# EasyEDA Pro project H4ptiX.epro

# Schematic Board
Board Name: Board; Create Date: 2025-03-30; Page Name: SCH; Project Name: H4ptiX Basic; Schematic Name: Board; Update Date: 2025-03-30; Add into BOM: yes; Company: @UTBDK; Convert to PCB: yes; Date: 2025-03-15; Draw By: buglloc; REV: 1.1; Sheet: 1/1; spicePre: .
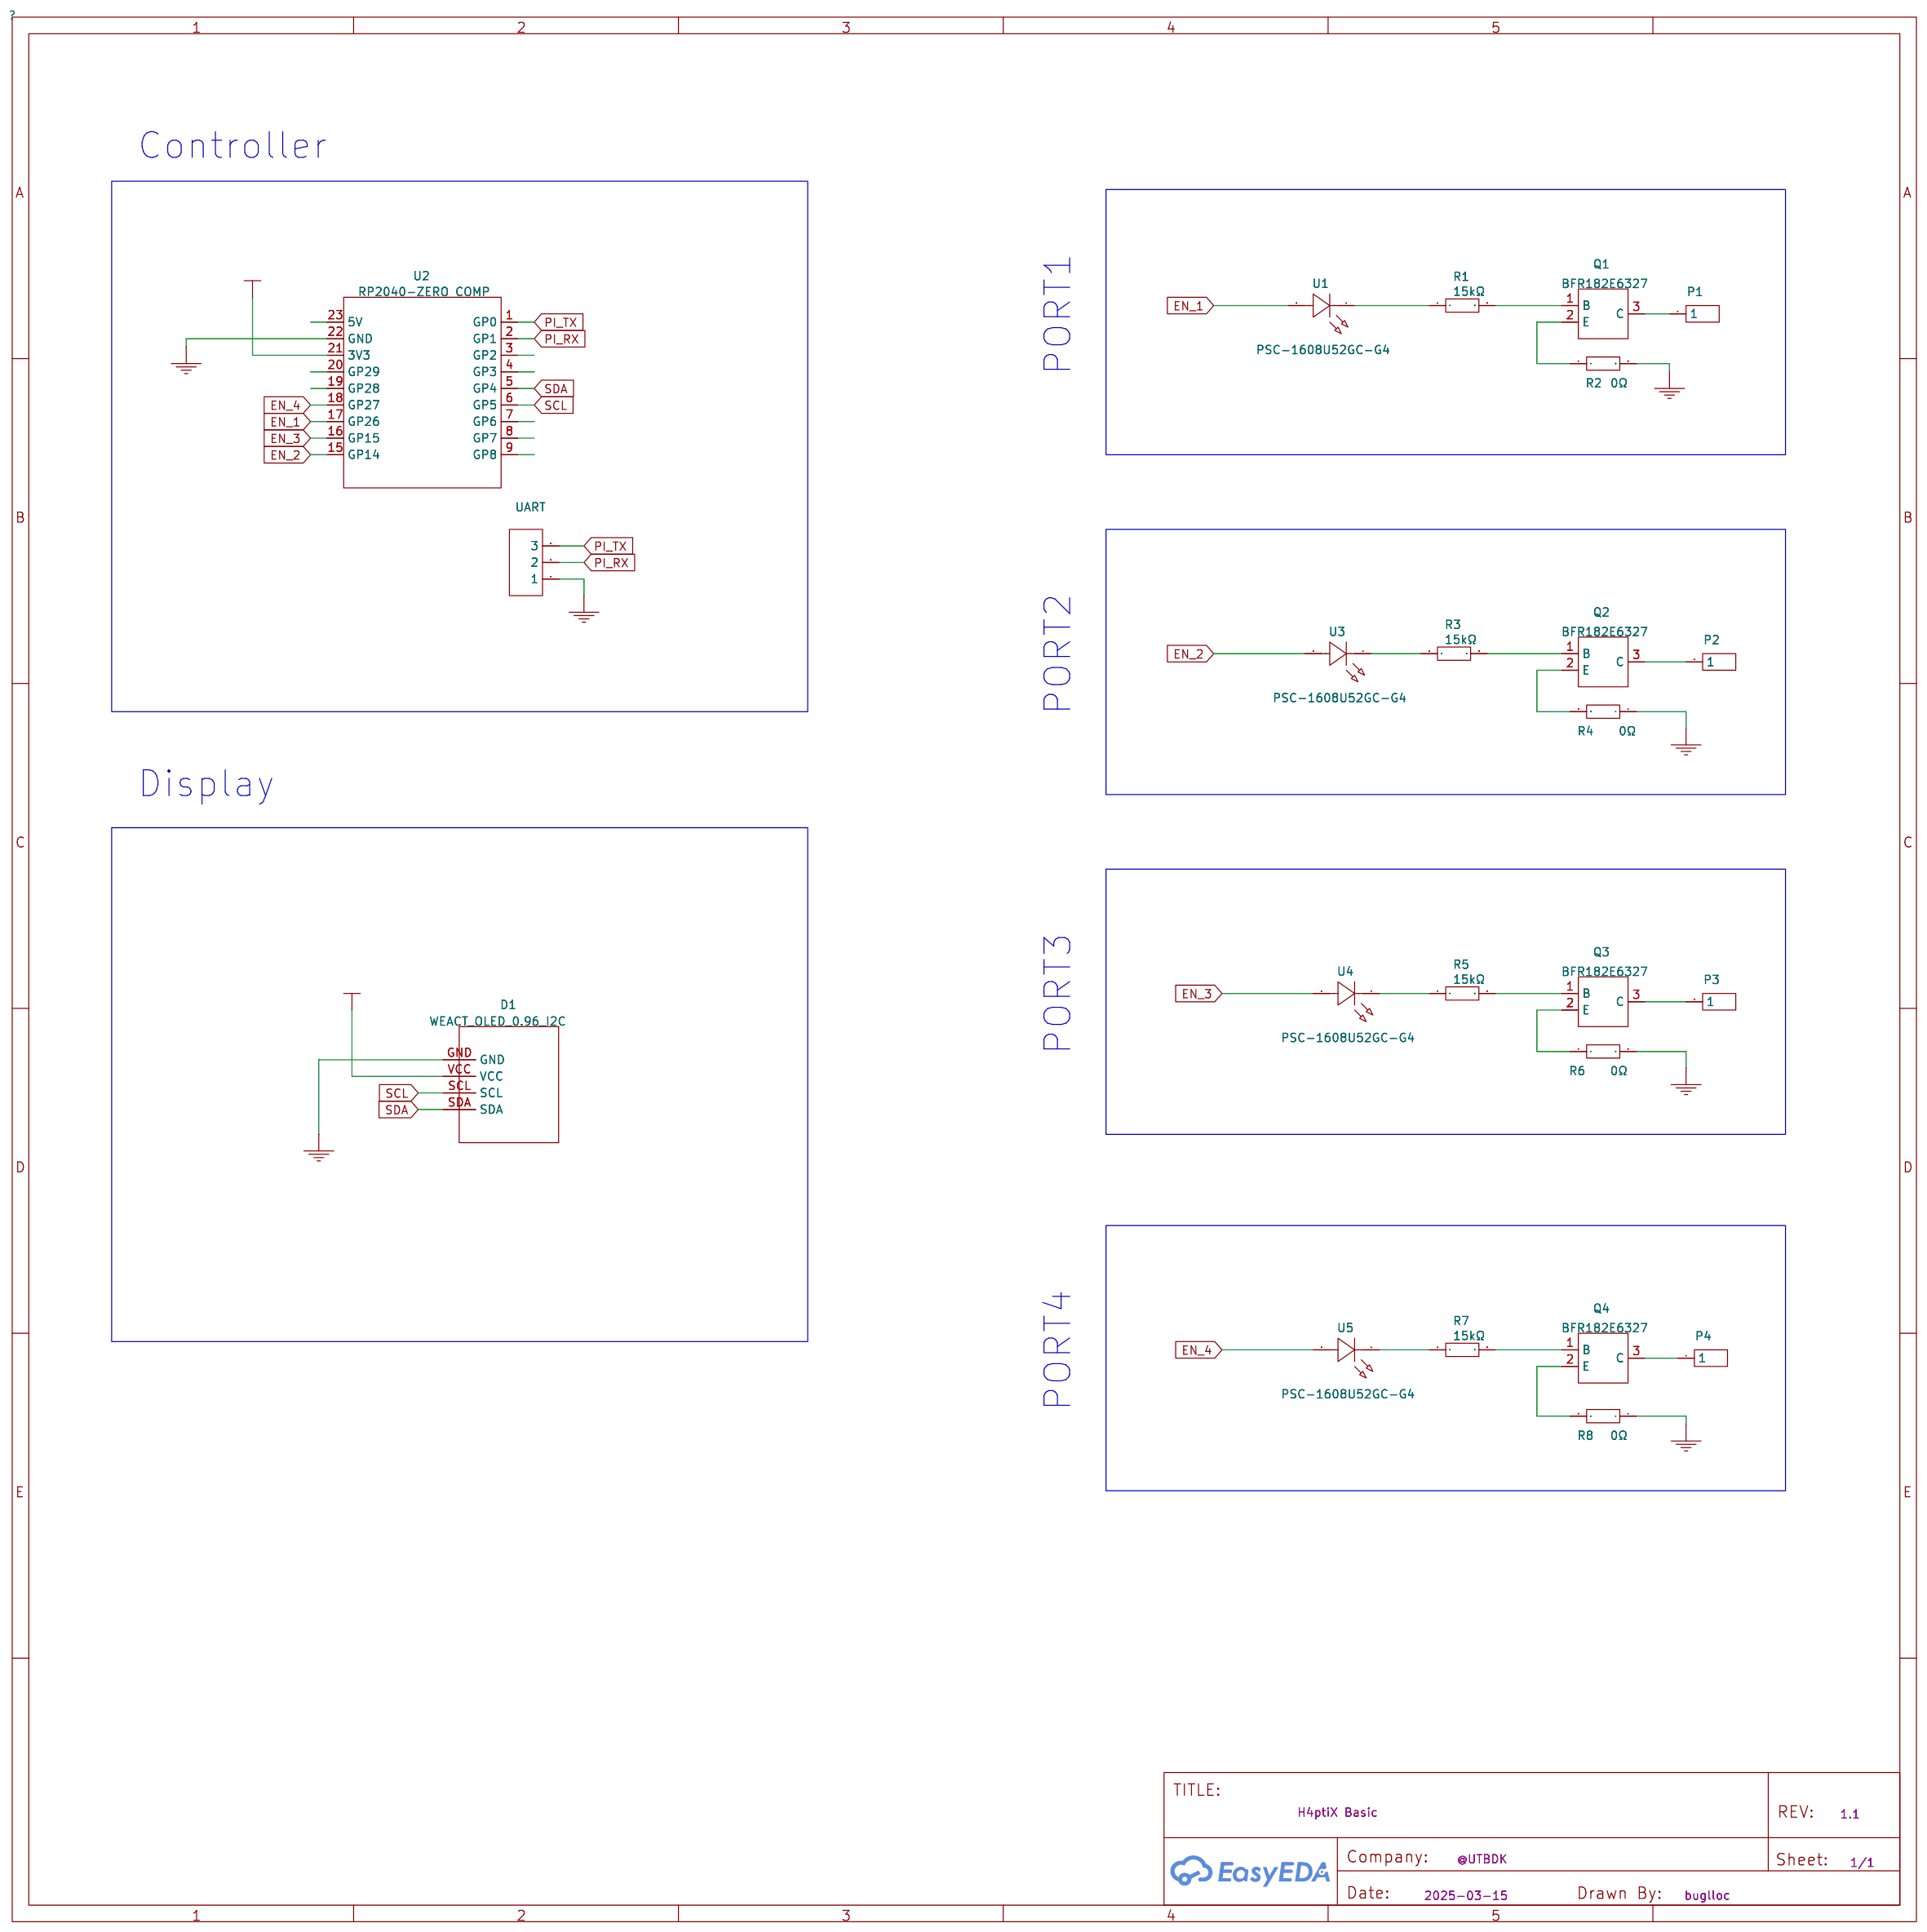
[diagram p0: schematic sheet]

## Parts
D1  WEACT_OLED_0.96_I2C  [WEACT_OLED_0.96_I2C]
P1  HDR-M-2.54_1x1  [HDR-M-2.54_1X1]
P2  HDR-M-2.54_1x1  [HDR-M-2.54_1X1]
P3  HDR-M-2.54_1x1  [HDR-M-2.54_1X1]
P4  HDR-M-2.54_1x1  [HDR-M-2.54_1X1]
Q1  BFR182E6327  [SOT-23-3_L2.9-W1.3-P1.90-LS2.4-BR]
Q2  BFR182E6327  [SOT-23-3_L2.9-W1.3-P1.90-LS2.4-BR]
Q3  BFR182E6327  [SOT-23-3_L2.9-W1.3-P1.90-LS2.4-BR]
Q4  BFR182E6327  [SOT-23-3_L2.9-W1.3-P1.90-LS2.4-BR]
R1  15kΩ  [R0603]
R2  0Ω  [R0603]
R3  15kΩ  [R0603]
R4  0Ω  [R0603]
R5  15kΩ  [R0603]
R6  0Ω  [R0603]
R7  15kΩ  [R0603]
R8  0Ω  [R0603]
U1  PSC-1608U52GC-G4  [LED0603-RD_GREEN]
U2  RP2040-ZERO COMP  [RP2040-ZERO NO FOOTS]
U3  PSC-1608U52GC-G4  [LED0603-RD_GREEN]
U4  PSC-1608U52GC-G4  [LED0603-RD_GREEN]
U5  PSC-1608U52GC-G4  [LED0603-RD_GREEN]
UART  UART  [HDR-M-2.54_1X3]

## Library data of the parts
D1 = WEACT_OLED_0.96_I2C: Contributor: buglloc; spicePre: ?
P1-P4 = HDR-M-2.54_1x1: Supplier Part: C81276; Supplier: LCSC; Contributor: LCEDA_Lib; spicePre: J
Q1-Q4 = BFR182E6327: Supplier: LCSC; Supplier Part: C178311; Manufacturer: Infineon(英飞凌); JLCPCB Part Class: Extended Part; Contributor: LCSC; spicePre: Q
R1 R3 R5 R7 = 15kΩ: Supplier: LCSC; Manufacturer: UNI-ROYAL(厚声); Manufacturer Part: 0603WAF1502T5E; Supplier Part: C22809; JLCPCB Part Class: Basic Part; nameAlias: Value; spicePre: R; spiceSymbolName: 0603WAF1502T5E
R2 R4 R6 R8 = 0Ω: Supplier: LCSC; Manufacturer: UNI-ROYAL(厚声); Manufacturer Part: 0603WAF0000T5E; Supplier Part: C21189; JLCPCB Part Class: Basic Part; nameAlias: Value; spicePre: R; spiceSymbolName: 0603WAF0000T5E
U1 U3-U5 = PSC-1608U52GC-G4: Supplier: LCSC; Supplier Part: C22371297; Manufacturer: HONGLITRONIC(鸿利光电); JLCPCB Part Class: Extended Part; Contributor: lcsc; spicePre: U
U2 = RP2040-ZERO COMP: Contributor: buglloc; spicePre: U; Package Display: No
UART = UART: Supplier Part: C180248; Supplier: LCSC; Contributor: LCEDA_Lib; spicePre: J; spiceSymbolName: HDR-M-2.54_1x3

## Nets
3V3: D1.VCC U2.21(3V3)
GND: D1.GND R2.2 R4.1 R6.2 R8.1 U2.22(GND) UART.1
EN_1: U1.2(A) U2.17(GP26)
EN_2: U2.15(GP14) U3.2(A)
EN_3: U2.16(GP15) U4.2(A)
EN_4: U2.18(GP27) U5.2(A)
PI_RX: U2.2(GP1) UART.2
PI_TX: U2.1(GP0) UART.3
SCL: D1.SCL U2.6(GP5)
SDA: D1.SDA U2.5(GP4)
P1_1: P1.1 Q1.3(C)
Q1_1: Q1.1(B) R1.2
Q1_2: Q1.2(E) R2.1
Q2_3: P2.1 Q2.3(C)
Q3_3: P3.1 Q3.3(C)
Q4_3: P4.1 Q4.3(C)
R1_1: R1.1 U1.1(K)
R3_1: R3.1 U3.1(K)
R3_2: Q2.1(B) R3.2
R4_2: Q2.2(E) R4.2
R5_1: R5.1 U4.1(K)
R5_2: Q3.1(B) R5.2
R6_1: Q3.2(E) R6.1
R7_1: R7.1 U5.1(K)
R7_2: Q4.1(B) R7.2
R8_2: Q4.2(E) R8.2

Not connected (* = marked no-connect by the designer): U2 3(GP2) 4(GP3) 7(GP6) 8(GP7) 9(GP8) 19(GP28) 20(GP29) 23(5V)

## Notes on the sheet
- Controller
- PORT1
- PORT2
- Display
- PORT3
- PORT4

# Board PCB
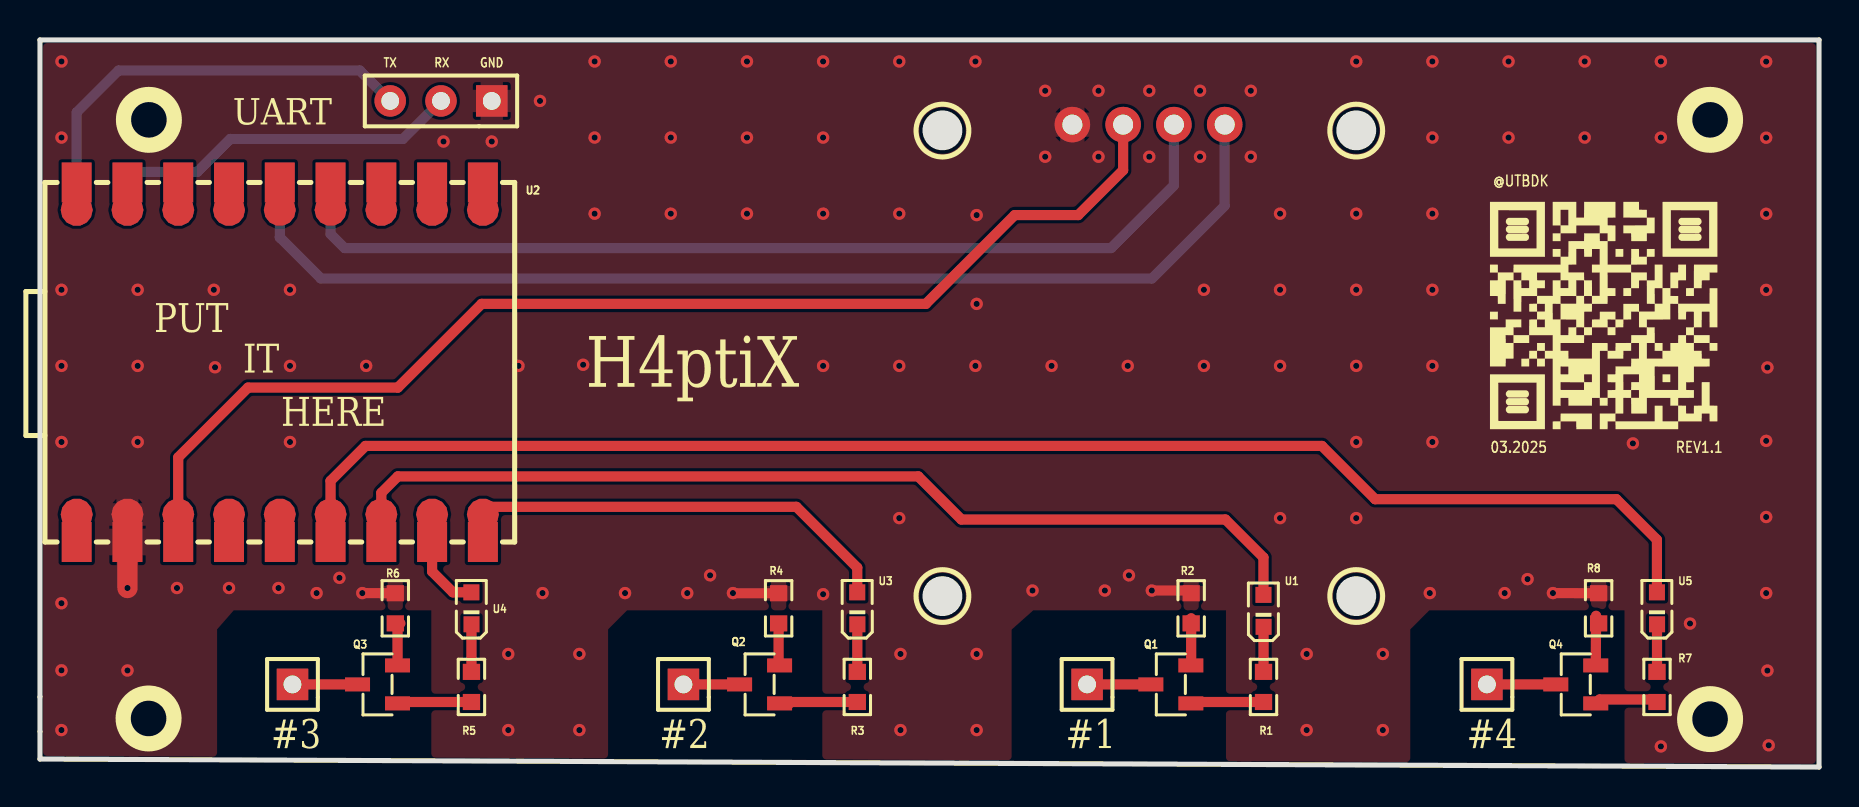
[diagram p1: board, top side]
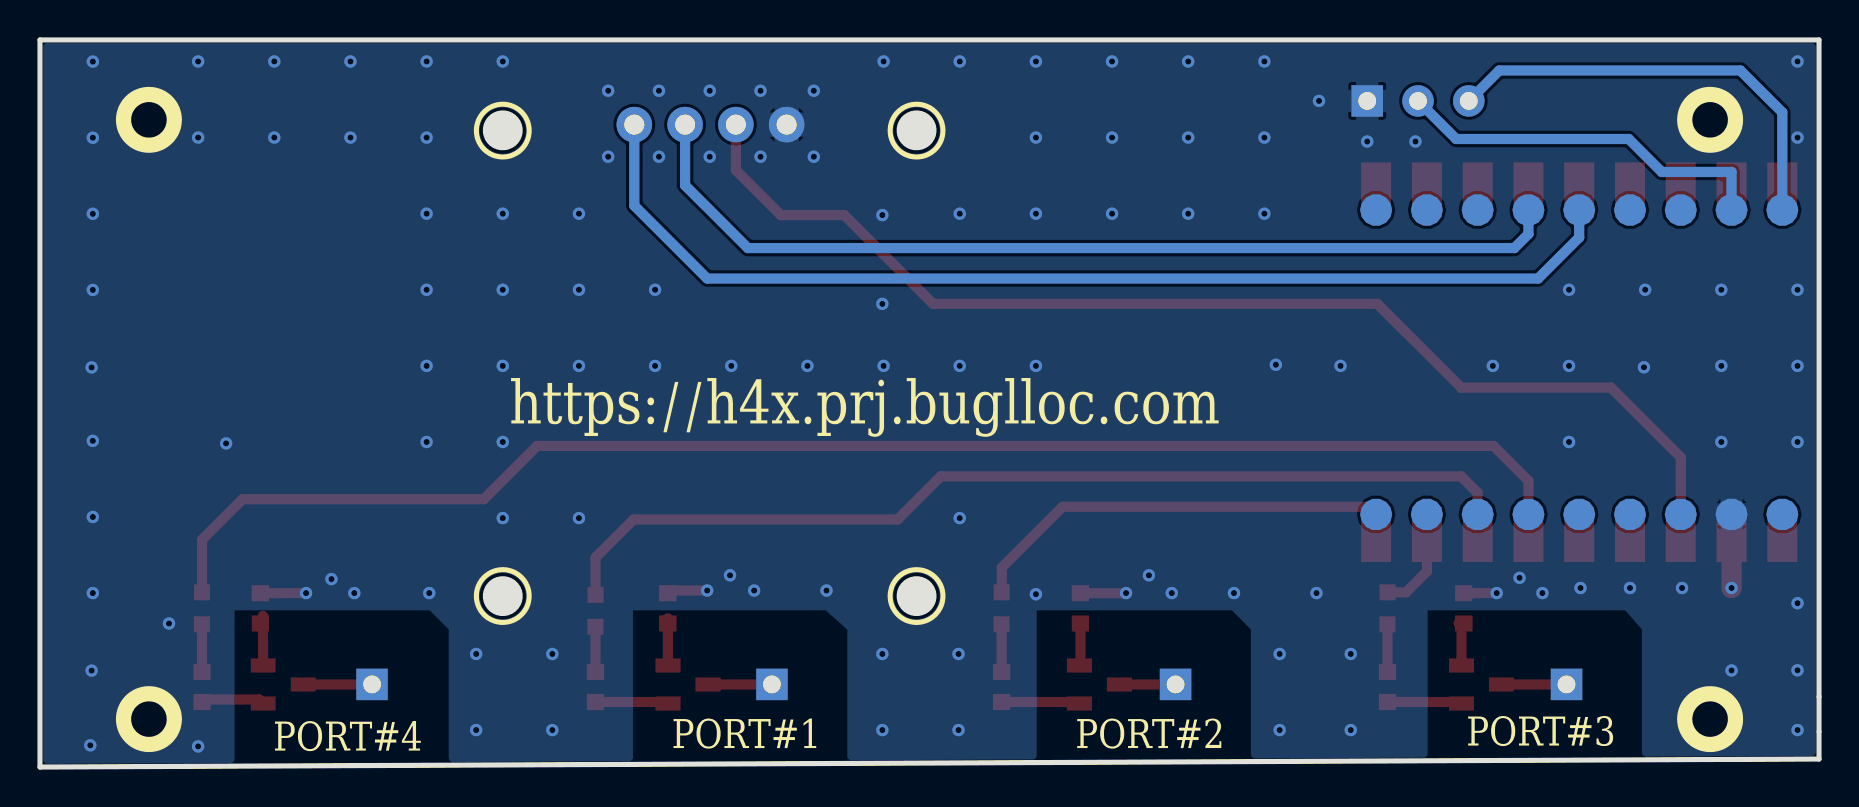
[diagram p2: board, bottom side, seen from below]

Outline 89 x 36.4 mm; copper layers: Top Layer, Bottom Layer. Coordinates in mm from the lower left corner of the outline.
Outline path: 0,36.4 89,36.4 89,0 0,0.4 0,36.4
Stack: Top Layer 0.035mm / Dielectric1 1.51mm FR4 er 4.5 / Bottom Layer 0.035mm

## Design rules (mm)
spacing Default (default): track to track 0.152, other pairs 0 to 0.152
track width Default (default): min 0.254, default 0.254, max 25.4
differential pair differentialPair (default): width min 0.127, default 0.254, max 2.54; gap min 0.152, default 0.152
via Default (default): diameter min 0.61, default 0.61, max 100.025; hole min 0.305, default 0.305, max 59.995
pour e21 uses gge28388
pour e98 uses gge28388(1)

## Placement (name value [footprint] x y rotation side)
D1  -  [WEACT_OLED_0.96_I2C]  55.37 20.9 0 top
P1  HDR-M-2.54_1x1  [HDR-M-2.54_1X1]  52.38 4.14 0 top
P2  HDR-M-2.54_1x1  [HDR-M-2.54_1X1]  32.19 4.14 0 top
P3  HDR-M-2.54_1x1  [HDR-M-2.54_1X1]  12.63 4.14 0 top
P4  HDR-M-2.54_1x1  [HDR-M-2.54_1X1]  72.38 4.14 0 top
Q1  BFR182E6327  [SOT-23-3_L2.9-W1.3-P1.90-LS2.4-BR]  56.57 4.14 0 top
Q2  BFR182E6327  [SOT-23-3_L2.9-W1.3-P1.90-LS2.4-BR]  36 4.14 0 top
Q3  BFR182E6327  [SOT-23-3_L2.9-W1.3-P1.90-LS2.4-BR]  16.89 4.14 0 top
Q4  BFR182E6327  [SOT-23-3_L2.9-W1.3-P1.90-LS2.4-BR]  76.83 4.14 0 top
R1  15kΩ  [R0603]  61.21 4.01 270 top
R2  0Ω  [R0603]  57.59 7.95 90 top
R3  15kΩ  [R0603]  40.89 4.01 270 top
R4  0Ω  [R0603]  36.95 7.95 270 top
R5  15kΩ  [R0603]  21.58 4.01 270 top
R6  0Ω  [R0603]  17.77 7.95 90 top
R7  15kΩ  [R0603]  80.89 4.01 270 top
R8  0Ω  [R0603]  77.97 7.95 270 top
U1  PSC-1608U52GC-G4  [LED0603-RD_GREEN]  61.21 7.82 90 top
U2  RP2040-ZERO COMP  [RP2040-ZERO NO FOOTS]  12 20.27 90 top
U3  PSC-1608U52GC-G4  [LED0603-RD_GREEN]  40.89 7.95 90 top
U4  PSC-1608U52GC-G4  [LED0603-RD_GREEN]  21.58 7.95 90 top
U5  PSC-1608U52GC-G4  [LED0603-RD_GREEN]  80.89 7.95 90 top
UART  UART  [HDR-M-2.54_1X3]  20.06 33.35 180 top

## Footprints (pads in the part's own frame, mm; a bottom-side part is the same pattern mirrored in y, then rotated)
HDR-M-2.54_1X1
  rect 1.575x1.575 hole 0.889: 1(0,0)
HDR-M-2.54_1X3
  rect 1.575x1.575 hole 0.889: 1(-2.54,0)
  round 1.575 hole 0.889: 2(0,0) 3(2.54,0)
LED0603-RD_GREEN
  rect 0.8x0.8 smd: 1(-0.799,-0.004) 2(0.799,0.004)
R0603
  rect 0.806x0.864 smd: 1(-0.753,0) 2(0.753,0)
RP2040-ZERO NO FOOTS
  custom 1.56x1.6 hole 1.005x1: 1(7.62,10.16) 2(7.62,7.62) 3(7.62,5.08) 4(7.62,2.54) 5(7.62,0) 6(7.62,-2.54) 7(7.62,-5.08) 8(7.62,-7.62) 9(7.62,-10.16) 15(-7.62,-10.16) 16(-7.62,-7.62) 17(-7.62,-5.08) 18(-7.62,-2.54) 19(-7.62,0) 20(-7.62,2.54) 21(-7.62,5.08) 22(-7.62,7.62) 23(-7.62,10.16)
  rect 2x1.5 smd: 1(9,10.16) 2(9,7.62) 3(9,5.08) 4(9,2.54) 5(9,0) 6(9,-2.54) 7(9,-5.08) 8(9,-7.62) 9(9,-10.16) 15(-9,-10.16) 16(-9,-7.62) 17(-9,-5.08) 18(-9,-2.54) 19(-9,0) 20(-9,2.54) 21(-9,5.08) 22(-9,7.62) 23(-9,10.16)
SOT-23-3_L2.9-W1.3-P1.90-LS2.4-BR
  rect 1.25x0.7 smd: 1(1,-0.95) 2(1,0.95) 3(-1,0)
WEACT_OLED_0.96_I2C
  round 1.778 hole 1x1: GND(-3.72,11.26) SCL(1.36,11.26) SDA(3.9,11.26) VCC(-1.18,11.26)

## Nets
As in the schematic.

Pads without a net: U2 3 4 7 8 9 19 20 23

## Via types
v1: diameter 0.62, hole 0.31, Top Layer to Bottom Layer, 126 vias

## Routing (per net, layer and track width the routed paths; a pad name or vN(x,y) marks a point on that pad's centre or on a via; arc(x,y) is an arc through that point)
3V3: length 58.4
  Top Layer w0.508: 54.19,32.16 54.19,29.88 51.94,27.63 48.76,27.63 44.32,23.19 22.09,23.19 17.9,19 10.41,19 6.92,15.5 U2.21
GND: length 11.8
  Top Layer w0.508: R4.1 34.67,8.7 v1(34.67,8.71) ; 57.59,8.7 57.59,8.84 v1(55.62,8.84) ; 17.77,8.7 v1(16.12,8.71) ; 77.72,8.7 v1(75.69,8.71)
  Top Layer w1.016: U2.22 v1(4.38,8.96)
  vias: v1(1.08,35.32) v1(1.08,31.51) v1(1.08,23.89) v1(1.08,20.08) v1(1.08,16.27) v1(1.07,8.2) v1(1.08,4.84) v1(1.07,1.85) v1(4.38,4.84) v1(4.89,23.89) v1(4.89,20.08) v1(4.89,16.27) v1(6.85,8.96) v1(8.7,23.89) v1(8.76,20.01) v1(9.46,8.96) v1(11.93,8.96) v1(12.51,23.89) v1(12.51,20.08) v1(12.51,16.27) v1(13.84,8.71) v1(14.98,9.47) v1(16.32,20.08) v1(20.19,31.32) v1(22.6,31.32) v1(23.43,5.66) v1(23.43,1.85) v1(23.94,20.08) v1(25.01,33.35) v1(25.14,8.71) v1(26.98,5.66) v1(26.98,1.85) v1(27.17,20.14) v1(27.75,35.32) v1(27.75,31.51) v1(27.75,27.7) v1(29.27,8.71) v1(31.56,35.32) v1(31.56,31.51) v1(31.56,27.7) v1(32.38,8.71) v1(33.52,9.6) v1(35.37,35.32) v1(35.37,31.51) v1(35.37,27.7) v1(39.18,35.32) v1(39.18,31.51) v1(39.18,27.7) v1(39.18,20.08) v1(39.18,8.65) v1(42.99,35.32) v1(42.99,27.7) v1(42.99,20.08) v1(42.99,12.46) v1(43.05,5.66) v1(43.05,1.85) v1(46.8,35.32) v1(46.8,20.08) v1(46.86,27.63) v1(46.86,23.19) v1(46.86,5.66) v1(46.86,1.85) v1(49.65,8.84) v1(50.29,33.86) v1(50.29,30.55) v1(50.61,20.08) v1(52.95,33.86) v1(52.95,30.55) v1(53.27,8.84) v1(54.42,20.08) v1(54.48,9.6) v1(55.49,33.86) v1(55.49,30.55) v1(58.03,33.86) v1(58.03,30.55) v1(58.23,23.89) v1(58.23,20.08) v1(60.57,33.86) v1(60.57,30.55) v1(62.04,27.7) v1(62.04,23.89) v1(62.04,20.08) v1(62.04,12.46) v1(63.37,5.66) v1(63.37,1.85) v1(65.85,35.32) v1(65.85,27.7) v1(65.85,23.89) v1(65.85,20.08) v1(65.85,16.27) v1(65.85,12.46) v1(67.18,5.66) v1(67.18,1.85) v1(69.53,8.71) v1(69.66,35.32) v1(69.66,31.51) v1(69.66,27.7) v1(69.66,23.89) v1(69.66,20.08) v1(69.66,16.27) v1(73.27,8.71) v1(73.47,35.32) v1(73.47,31.51) v1(74.42,9.41) v1(77.28,35.32) v1(77.28,31.51) v1(79.69,16.2) v1(81.09,35.32) v1(81.09,31.51) v1(81.09,1.03) v1(82.54,7.19) v1(86.35,35.32) v1(86.35,31.51) v1(86.35,27.7) v1(86.35,23.89) v1(86.42,20.01) v1(86.35,16.33) v1(86.35,12.52) v1(86.35,8.71) v1(86.42,4.83) v1(86.48,1.09)
EN_1: length 49.1
  Top Layer w0.508: U1.2 61.21,10.49 59.3,12.39 46.1,12.39 43.94,14.55 17.9,14.55 17.08,13.73 U2.17
EN_2: length 21.4
  Top Layer w0.508: U2.15 22.54,13.03 37.84,13.03 40.89,9.98 U3.2
EN_3: length 5.3
  Top Layer w0.508: U2.16 U2.16 19.62,9.79 20.66,8.75 U4.2
EN_4: length 73.3
  Top Layer w0.508: U2.18 14.54,14.33 16.28,16.08 64.13,16.08 66.8,13.41 78.86,13.41 80.89,11.38 U5.2
P1_1: length 3.2
  Top Layer w0.508: P1.1 Q1.3
PI_RX: length 19.1
  Bottom Layer w0.508: U2.2 4.38,29.79 7.87,29.79 9.52,31.44 18.16,31.44 UART.2
PI_TX: length 22.4
  Bottom Layer w0.254: 17.26,33.61 UART.3
  Bottom Layer w0.508: UART.3 16,34.87 3.93,34.87 1.84,32.78 U2.1
Q1_1: length 3.5
  Top Layer w0.508: R1.2 57.83,3.26 57.76,3.19
Q1_2: length 2.4
  Top Layer w0.508: 57.59,7.45 57.59,5.1 Q1.2
Q2_3: length 3.1
  Top Layer w0.508: 31.94,4.14 35.06,4.14
Q3_3: length 3.3
  Top Layer w0.508: Q3.3 P3.1
Q4_3: length 3.3
  Top Layer w0.508: 72.58,4.14 Q4.3
R1_1: length 2.3
  Top Layer w0.508: R1.1 61.21,7.02 U1.1
R3_1: length 2.3
  Top Layer w0.508: 40.89,7.02 40.89,7.02 R3.1
R3_2: length 3.4
  Top Layer w0.508: 37.51,3.19 37.58,3.26 R3.2
R4_2: length 2.2
  Top Layer w0.508: R4.2 36.95,5.2 37.06,5.09
R5_1: length 2.4
  Top Layer w0.508: R5.1 21.58,7.14 U4.1
R5_2: length 3.6
  Top Layer w0.508: R5.2 18.08,3.26 18.01,3.19
R6_1: length 2.2
  Top Layer w0.508: 18.03,7.19 17.89,7.05 Q3.2
R7_1: length 2.3
  Top Layer w0.508: U5.1 80.89,7.14 80.89,4.89
R7_2: length 3.1
  Top Layer w0.508: 80.89,3.38 78.03,3.38 Q4.1
R8_2: length 2.5
  Top Layer w0.508: 77.83,5.09 77.85,7.57
SCL: length 48
  Bottom Layer w0.508: 56.73,32.16 56.73,29.12 53.59,25.98 15.24,25.98 14.54,26.68 U2.6
SDA: length 55.1
  Bottom Layer w0.508: 59.27,32.16 59.27,28.1 55.62,24.46 14.05,24.46 12,26.51 U2.5

## Copper pours and planes (outline as drawn; the poured copper is in the pictures)
GND on Top Layer: -2.55,41.09 -2.55,-0.94 8.76,-0.94 8.76,6.93 9.65,7.95 19.68,7.95 19.68,-0.94 28.32,-0.94 28.32,6.93 29.33,7.95 39.24,7.95 39.24,-0.94 48.51,-0.94 48.51,6.93 49.65,7.95 59.43,7.95 59.43,-0.94 68.45,-0.94 68.45,6.93 69.46,7.95 79.37,7.95 79.37,-0.94 91.05,-0.94 91.05,41.35 90.04,41.35
GND on Bottom Layer: -2.55,40.46 -2.55,-0.94 8.76,-0.94 8.76,6.93 9.65,7.95 19.68,7.95 19.68,-0.94 28.32,-0.94 28.32,6.93 29.33,7.95 39.24,7.95 39.24,-0.94 48.51,-0.94 48.51,6.93 49.65,7.95 59.43,7.95 59.43,-0.94 68.45,-0.94 68.45,6.93 69.46,7.95 79.37,7.95 79.37,-0.94 91.05,-0.94 91.05,40.71 90.04,40.71

## Text on the board
Bottom Silkscreen Layer: PORT#3 | PORT#2 | PORT#1 | PORT#4 | https://h4x.prj.buglloc.com
Top Silkscreen Layer: TX | RX | GND | 03.2025 | @UTBDK | REV1.1 | PUT | IT | #3 | HERE | #2 | #1 | #4 | H4ptiX
